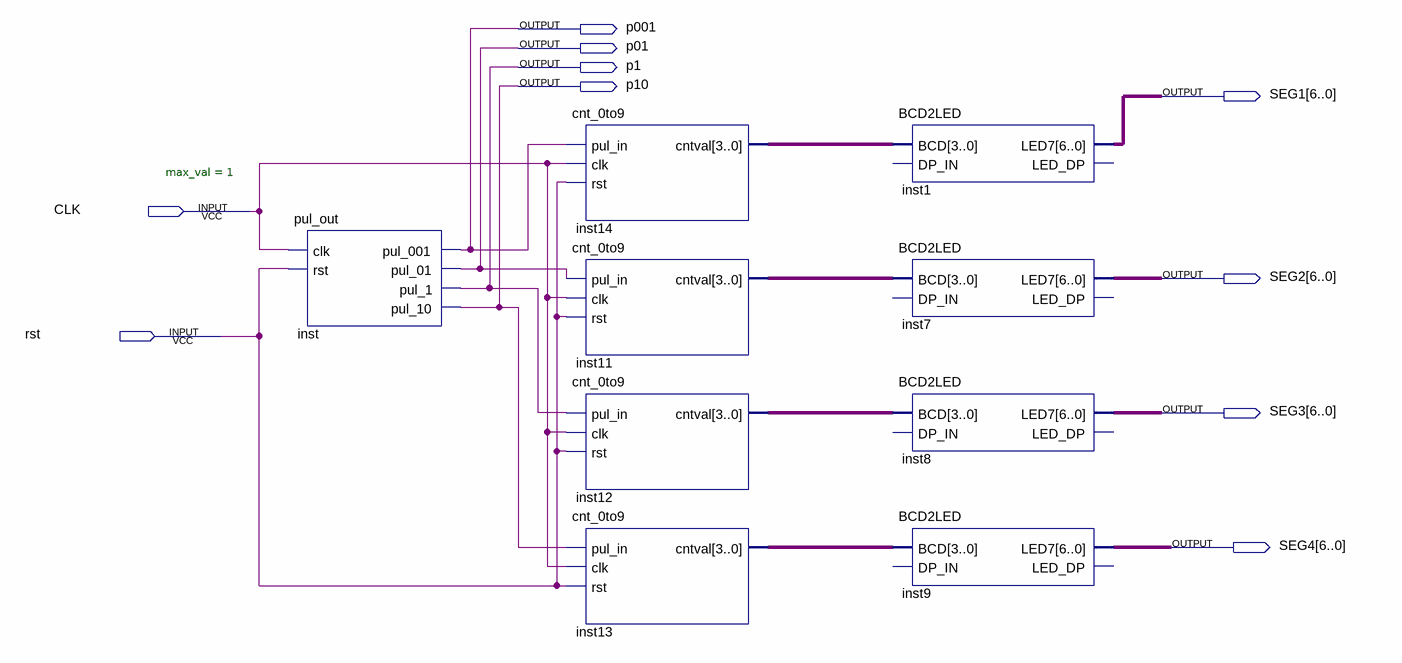
[diagram p0: schematic sheet]
// Quartus schematic timer_bdf.bdf as structural Verilog: 9 symbols, 10 pins
module timer_bdf (
  input  CLK,
  input  rst,
  output p001,
  output p01,
  output p1,
  output p10,
  output [6:0] SEG1,
  output [6:0] SEG2,
  output [6:0] SEG3,
  output [6:0] SEG4
);

  wire [3:0] inst11_cntval, inst12_cntval, inst13_cntval, inst14_cntval;

  pul_out #(.max_val(1)) inst (.clk(CLK), .rst(rst), .pul_001(p001), .pul_01(p01), .pul_1(p1), .pul_10(p10));
  cnt_0to9 inst14 (.pul_in(p001), .clk(CLK), .rst(rst), .cntval(inst14_cntval));
  cnt_0to9 inst11 (.pul_in(p01), .clk(CLK), .rst(rst), .cntval(inst11_cntval));
  cnt_0to9 inst12 (.pul_in(p1), .clk(CLK), .rst(rst), .cntval(inst12_cntval));
  cnt_0to9 inst13 (.pul_in(p10), .clk(CLK), .rst(rst), .cntval(inst13_cntval));
  BCD2LED inst1 (.BCD(inst14_cntval), .LED7(SEG1));  // open: DP_IN, LED_DP
  BCD2LED inst7 (.BCD(inst11_cntval), .LED7(SEG2));  // open: DP_IN, LED_DP
  BCD2LED inst8 (.BCD(inst12_cntval), .LED7(SEG3));  // open: DP_IN, LED_DP
  BCD2LED inst9 (.BCD(inst13_cntval), .LED7(SEG4));  // open: DP_IN, LED_DP
endmodule
